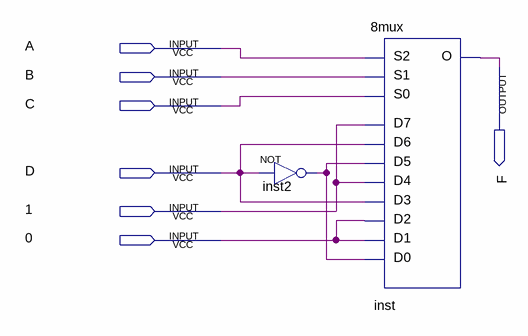
[diagram p0: schematic sheet]
// Quartus schematic hw6p4a.bdf as structural Verilog: 2 symbols, 7 pins
module hw6p4a (
  input  A,
  input  B,
  input  C,
  input  D,
  input  \1 ,
  input  \0 ,
  output F
);

  wire inst2_out;

  not inst2 (inst2_out, D);
  \8mux  inst (
    .S2(A), .S1(B), .S0(C), .D7(\1 ), .D6(D), .D5(inst2_out), .D4(\1 ), .D3(D), .D2(\0 ), .D1(\0 ),
    .D0(inst2_out), .O(F));
endmodule
